# Altium schematic sheet 780-00030,rev1,Pg1,Extended GPIO Apps board.SchDoc
size B; PageSetup: Record=PageOptions|CenterHorizontal=True|CenterVertical=True|PrintScale=1.09|XCorrection=1.00|YCorrection=1.00|PrintKind=0|BorderSize=5000000|LeftOffset=0|BottomOffset=0|Orientation=2|PaperLength=1000|PaperWidth=1000|Scale=100|PaperSource=7|PrintQuality=-4|MediaType=1|DitherType=10|PaperKind=Tabloid 11 x 17in|PrintScaleMode=1
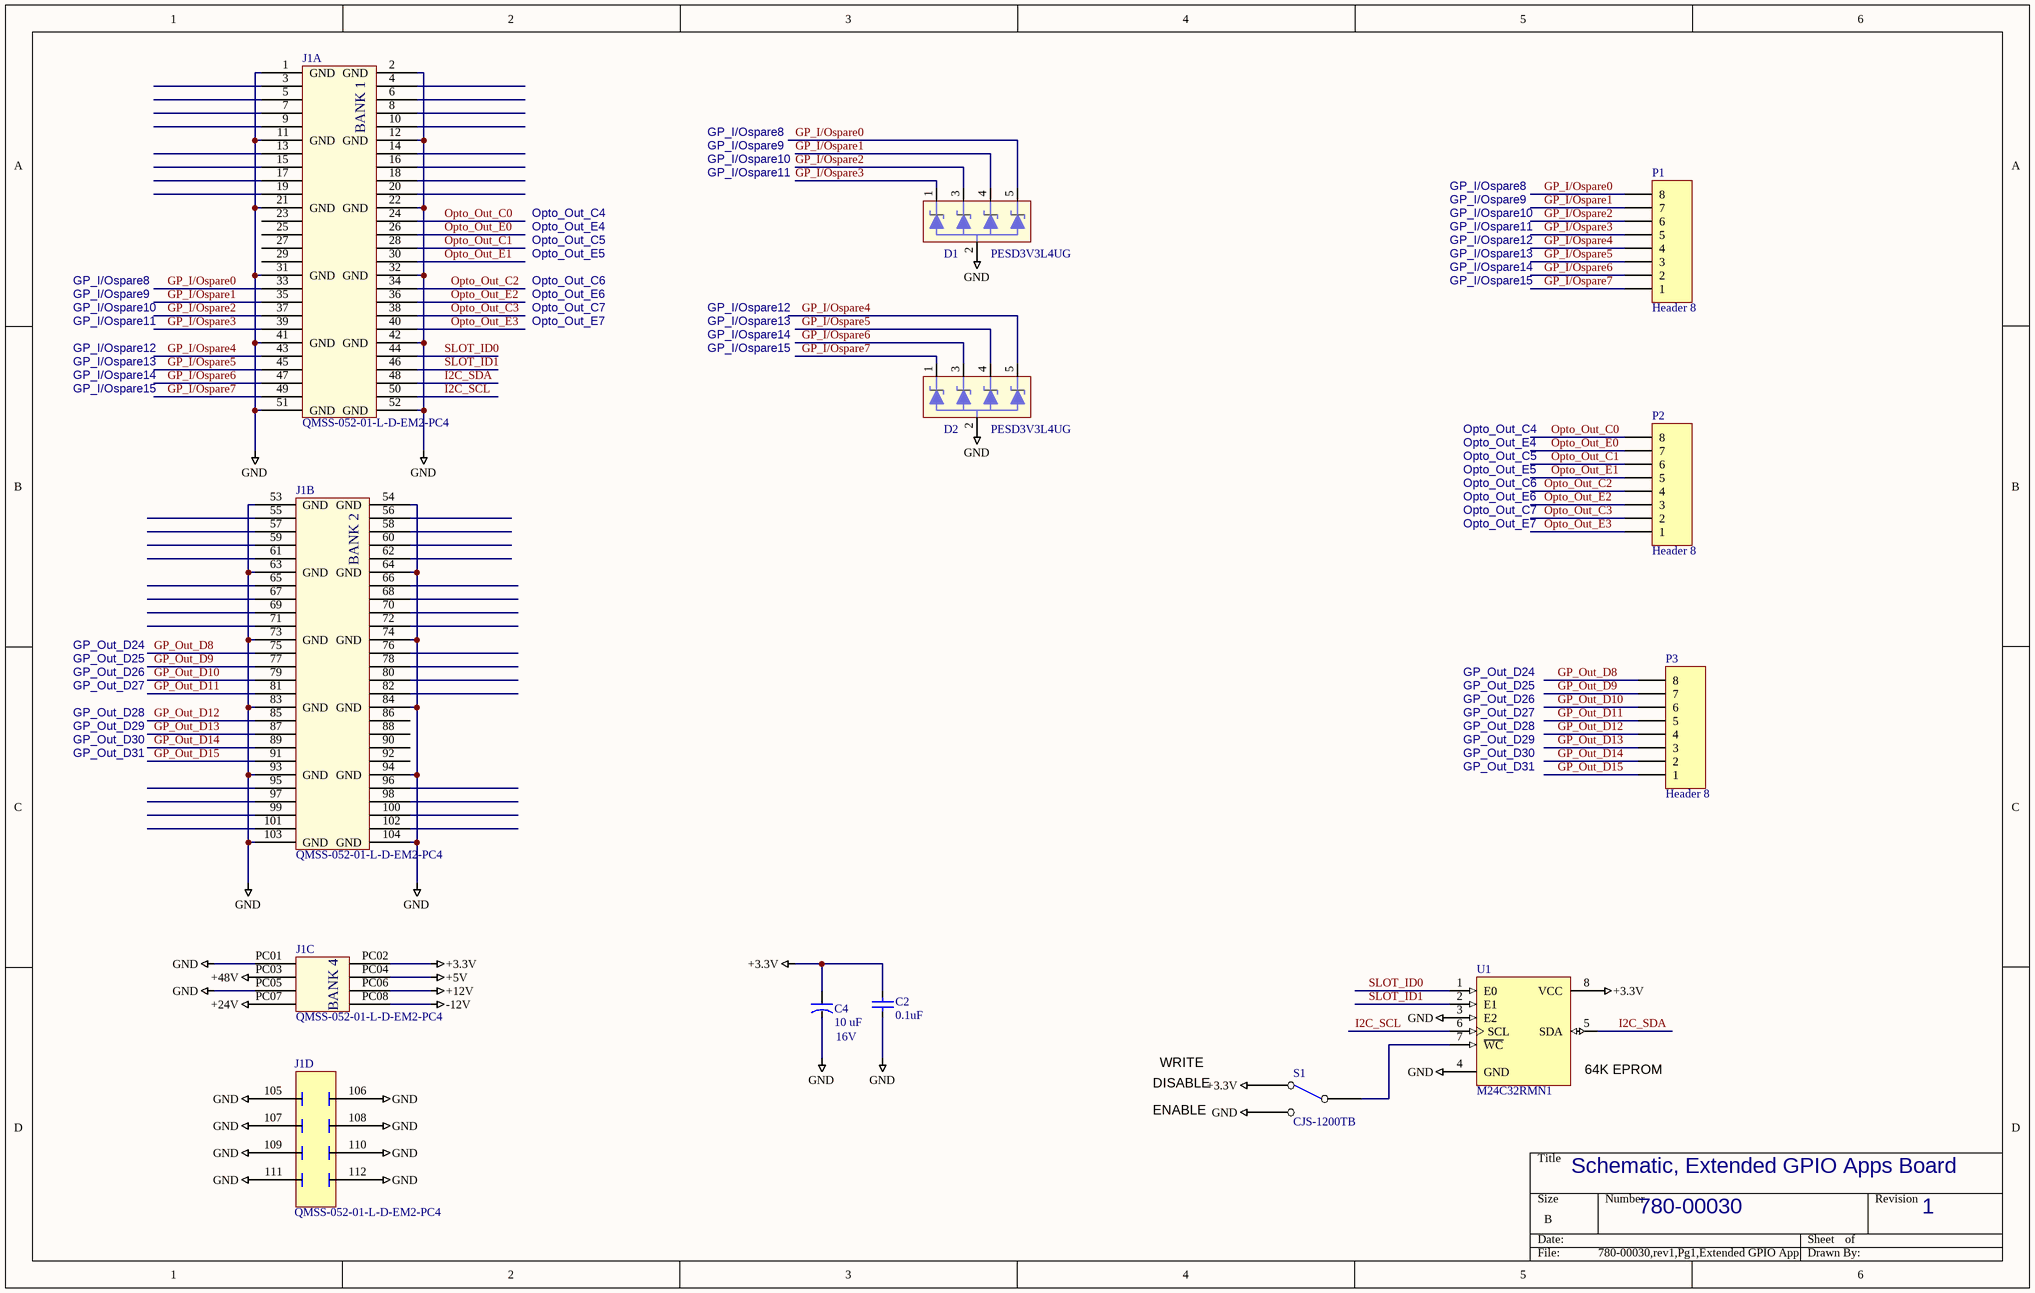
[diagram p0: 780-00030,rev1,Pg1,Extended GPIO Apps board.SchDoc]

## Parts
C2  value 0.1uF  [SMD_0805]  (hidden comment: Cap SMD)
C4  16V  value 10 uF  [SMD_CAP_3216]
D1  PESD3V3L4UG  [SOT-353]
D2  PESD3V3L4UG  [SOT-353]
J1  value QMSS-052-01-L-D-EM2-PC4  [QMS EDGE PWR PINS - 104 pin]  (hidden comment: QMSS-EM-PC4-104pin)  (parts A,B,C,D of 4)
P1  Header 8  [HDR1X8 for IDC]
P2  Header 8  [HDR1X8 for IDC]
P3  Header 8  [HDR1X8 for IDC]
S1  CJS-1200TB  [CAS-120A]
U1  M24C32RMN1  [SOP8_N]

## Nets
+3.3V: C2.1 C4.1 J1.PC02 S1.3(NC) U1.8(VCC)
+5V: J1.PC04
+12V: J1.PC06
+24V: J1.PC07
+48V: J1.PC03
-12V: J1.PC08
GND: C2.2 C4.2 D1.2 D2.2 J1.1(GND) J1.2(GND) J1.11(GND) J1.12(GND) J1.21(GND) J1.22(GND) J1.31(GND) J1.32(GND) J1.41(GND) J1.42(GND) J1.51(GND) J1.52(GND) J1.53(GND) J1.54(GND) J1.63(GND) J1.64(GND) J1.73(GND) J1.74(GND) J1.83(GND) J1.84(GND) J1.93(GND) J1.94(GND) J1.103(GND) J1.104(GND) J1.105(GND) J1.106(GND) J1.107(GND) J1.108(GND) J1.109(GND) J1.110(GND) J1.111(GND) J1.112(GND) J1.PC01 J1.PC05 S1.1(NO) U1.3(E2) U1.4(GND)
GP_I/Ospare0: D1.5 J1.33 P1.8
GP_I/Ospare1: D1.4 J1.35 P1.7
GP_I/Ospare2: D1.3 J1.37 P1.6
GP_I/Ospare3: D1.1 J1.39 P1.5
GP_I/Ospare4: D2.5 J1.43 P1.4
GP_I/Ospare5: D2.4 J1.45 P1.3
GP_I/Ospare6: D2.3 J1.47 P1.2
GP_I/Ospare7: D2.1 J1.49 P1.1
GP_Out_D8: J1.75 P3.8
GP_Out_D9: J1.77 P3.7
GP_Out_D10: J1.79 P3.6
GP_Out_D11: J1.81 P3.5
GP_Out_D12: J1.85 P3.4
GP_Out_D13: J1.87 P3.3
GP_Out_D14: J1.89 P3.2
GP_Out_D15: J1.91 P3.1
I2C_SCL: J1.50 U1.6(SCL)
I2C_SDA: J1.48 U1.5(SDA)
Opto_Out_C0: J1.24 P2.8
Opto_Out_C1: J1.28 P2.6
Opto_Out_C2: J1.34 P2.4
Opto_Out_C3: J1.38 P2.2
Opto_Out_E0: J1.26 P2.7
Opto_Out_E1: J1.30 P2.5
Opto_Out_E2: J1.36 P2.3
Opto_Out_E3: J1.40 P2.1
SLOT_ID0: J1.44 U1.1(E0)
SLOT_ID1: J1.46 U1.2(E1)
NetS1_2: S1.2(COM) U1.7(~{WC})

Not connected (* = marked no-connect by the designer): J1 3 4 5 6 7 8 9 10 13 14 15 16 17 18 19 20 23 25 27 29 55 56 57 58 59 60 61 62 65 66 67 68 69 70 71 72 76 78 80 82 86 88 90 92 95 96 97 98 99 100 101 102

## Notes on the sheet
- GP_I/Ospare8
- GP_I/Ospare9
- GP_I/Ospare10
- Opto_Out_C4
- Opto_Out_E4
- GP_I/Ospare11
- Opto_Out_C5
- Opto_Out_C6
- Opto_Out_E5
- Opto_Out_E6
- GP_I/Ospare12
- GP_I/Ospare13
- GP_I/Ospare14
- GP_I/Ospare15
- Opto_Out_C7
- Opto_Out_E7
- GP_Out_D24
- GP_Out_D25
- GP_Out_D26
- GP_Out_D27
- GP_Out_D28
- GP_Out_D29
- GP_Out_D30
- GP_Out_D31
- DISABLE
- WRITE
- (near U1) 64K EPROM
- ENABLE
- Schematic, Extended GPIO Apps Board
- 780-00030
- 1
- (in symbol QMSS-EM-PC4-104pin, part A) BANK 1
- (in symbol QMSS-EM-PC4-104pin, part B) BANK 2
- (in symbol QMSS-EM-PC4-104pin, part C) BANK 4

## Library data of the parts
C2 = Cap SMD: Capacitor; LCO p/n: 120-00002
C4 = Cap Tant 16V: outline 3.2mm x 1.6mm; Manufacturer: KEMET; Manuf p/n: T494A106M016AT; Vendor: DIGIKEY; Vendor p/n: 399-3824-1-ND; Vendor Mult.: 1; LCO p/n: 120-00001; COST: 0.78
D1 D2 = ESD Diode 3.3V Quad: Quad ESD Diode 3.3V; Manufacturer: NXP; Manuf p/n: PESD3V3L4UG,115; LCO p/n: 140-00011; VALUE: 3V3; Vendor: DigiKey; Vendor Mult.: 1; Vendor p/n: 568-4042-1-ND; COST: 0.52
J1 = QMSS-EM-PC4-104pin: SAMTEC QMSS EDGE W/PWR PINS; Vendor: SAMETC; Vendor Mult.: 1; LCO p/n: 125-00059; Manufacturer: SAMTEC; Manuf p/n: QMSS-052-01-L-D-EM2-PC4; Vendor p/n: QMSS-052-01-L-D-EM2-PC4; COST: 20.00
P1-P3 = Header 8: Header, 8-Pin; LCO p/n: 125-00047; VALUE: Header 8
S1 = SW_SPDT_DOUG: Manufacturer: Copal Electronics; Manuf p/n: CAS-120TB; Vendor: DIGIKEY; Vendor Mult.: 1; Vendor p/n: CAS120JCT-ND; LCO p/n: 185-00002; COST: 1.27; Value: SW_SPDT
U1 = M24C32RMN1: 32 Kbit Serial I²C Bus EEPROM; Manufacturer: ST Micro; Manuf p/n: M24C32-WMN6TP; LCO p/n: 150-00076; VALUE: M24C32; Vendor: DigiKey; Vendor Mult.: 1; Vendor p/n: 497-5027-1-ND; COST: 0.88